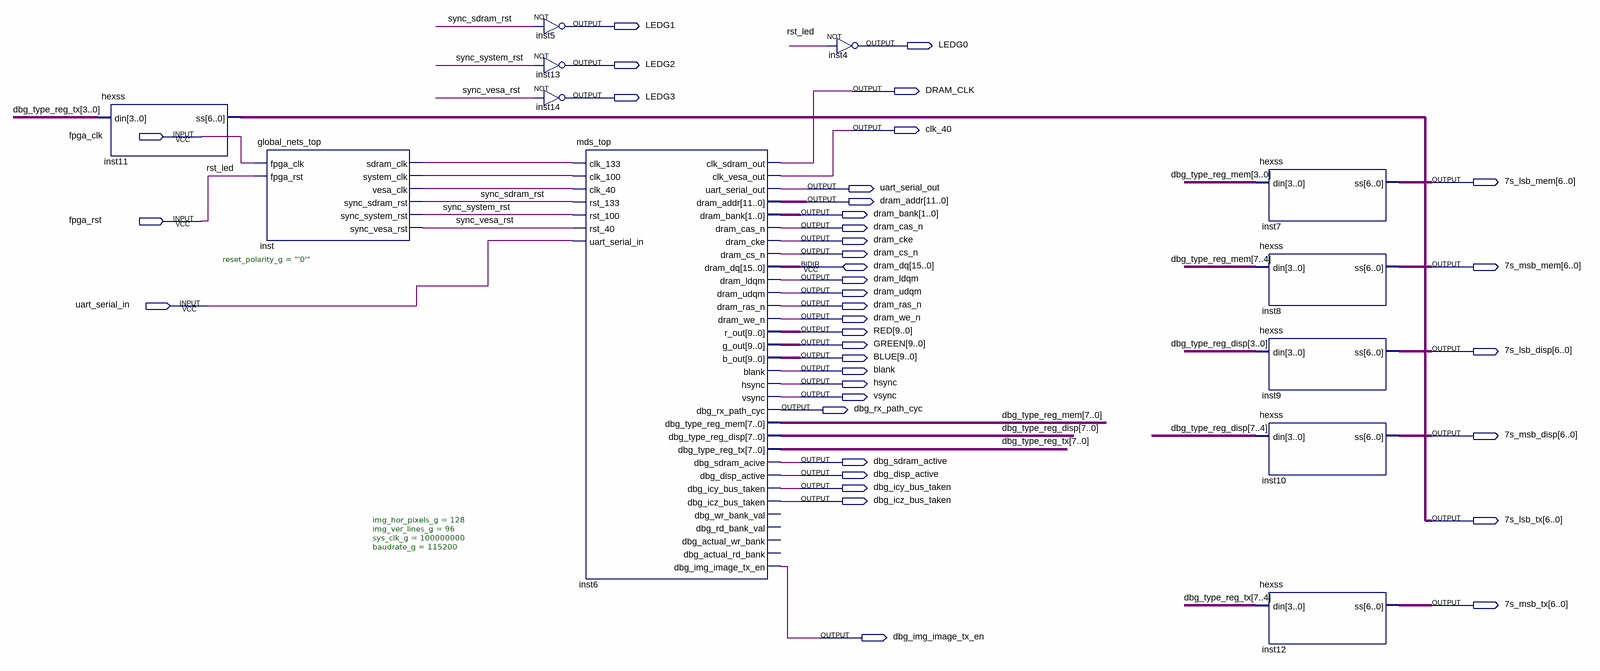
[diagram p0: schematic sheet]
// Quartus schematic sys_top.bdf as structural Verilog: 12 symbols, 38 pins
module sys_top (
  input  fpga_clk,
  input  fpga_rst,
  input  uart_serial_in,
  inout  [15:0] dram_dq,
  output LEDG1,
  output LEDG0,
  output LEDG2,
  output DRAM_CLK,
  output LEDG3,
  output clk_40,
  output [6:0] \7s_lsb_mem ,
  output uart_serial_out,
  output [11:0] dram_addr,
  output [1:0] dram_bank,
  output dram_cas_n,
  output dram_cke,
  output dram_cs_n,
  output [6:0] \7s_msb_mem ,
  output dram_ldqm,
  output dram_udqm,
  output dram_ras_n,
  output dram_we_n,
  output [9:0] RED,
  output [9:0] GREEN,
  output [6:0] \7s_lsb_disp ,
  output [9:0] BLUE,
  output blank,
  output hsync,
  output vsync,
  output dbg_rx_path_cyc,
  output [6:0] \7s_msb_disp ,
  output dbg_sdram_active,
  output dbg_disp_active,
  output dbg_icy_bus_taken,
  output dbg_icz_bus_taken,
  output [6:0] \7s_lsb_tx ,
  output [6:0] \7s_msb_tx ,
  output dbg_img_image_tx_en
);

  wire inst_sdram_clk, inst_system_clk, inst_vesa_clk, sync_sdram_rst, sync_system_rst, sync_vesa_rst;
  wire [7:0] dbg_type_reg_disp, dbg_type_reg_mem, dbg_type_reg_tx;

  hexss inst11 (.din(dbg_type_reg_tx[3:0]), .ss(\7s_lsb_tx ));
  global_nets_top #(.reset_polarity_g("'0'")) inst (
    .fpga_clk(fpga_clk), .fpga_rst(fpga_rst), .sdram_clk(inst_sdram_clk), .system_clk(inst_system_clk),
    .vesa_clk(inst_vesa_clk), .sync_sdram_rst(sync_sdram_rst), .sync_system_rst(sync_system_rst),
    .sync_vesa_rst(sync_vesa_rst));
  not inst5 (LEDG1, sync_sdram_rst);
  not inst13 (LEDG2, sync_system_rst);
  not inst14 (LEDG3, sync_vesa_rst);
  mds_top #(.img_hor_pixels_g(128), .img_ver_lines_g(96), .sys_clk_g(100000000), .baudrate_g(115200)) inst6 (
    .clk_133(inst_sdram_clk), .clk_100(inst_system_clk), .clk_40(inst_vesa_clk), .rst_133(sync_sdram_rst),
    .rst_100(sync_system_rst), .rst_40(sync_vesa_rst), .uart_serial_in(uart_serial_in),
    .clk_sdram_out(DRAM_CLK), .clk_vesa_out(clk_40), .uart_serial_out(uart_serial_out),
    .dram_addr(dram_addr), .dram_bank(dram_bank), .dram_cas_n(dram_cas_n), .dram_cke(dram_cke),
    .dram_cs_n(dram_cs_n), .dram_ldqm(dram_ldqm), .dram_udqm(dram_udqm), .dram_ras_n(dram_ras_n),
    .dram_we_n(dram_we_n), .r_out(RED), .g_out(GREEN), .b_out(BLUE), .blank(blank), .hsync(hsync),
    .vsync(vsync), .dbg_rx_path_cyc(dbg_rx_path_cyc), .dbg_type_reg_mem(dbg_type_reg_mem),
    .dbg_type_reg_disp(dbg_type_reg_disp), .dbg_type_reg_tx(dbg_type_reg_tx),
    .dbg_sdram_acive(dbg_sdram_active), .dbg_disp_active(dbg_disp_active),
    .dbg_icy_bus_taken(dbg_icy_bus_taken), .dbg_icz_bus_taken(dbg_icz_bus_taken),
    .dbg_img_image_tx_en(dbg_img_image_tx_en), .dram_dq(dram_dq));  // open: dbg_wr_bank_val, dbg_rd_bank_val, dbg_actual_wr_bank, dbg_actual_rd_bank
  not inst4 (LEDG0, fpga_rst);
  hexss inst7 (.din(dbg_type_reg_mem[3:0]), .ss(\7s_lsb_mem ));
  hexss inst8 (.din(dbg_type_reg_mem[7:4]), .ss(\7s_msb_mem ));
  hexss inst9 (.din(dbg_type_reg_disp[3:0]), .ss(\7s_lsb_disp ));
  hexss inst10 (.din(dbg_type_reg_disp[7:4]), .ss(\7s_msb_disp ));
  hexss inst12 (.din(dbg_type_reg_tx[7:4]), .ss(\7s_msb_tx ));

  // Other names for the same wires on the sheet: rst_led = fpga_rst
endmodule
